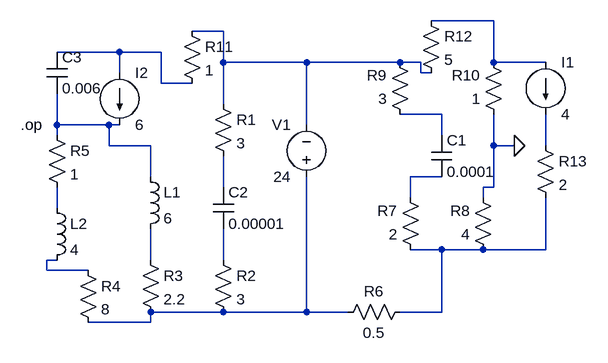
[diagram p0: schematic weirdRLC.asc]
weirdRLC.asc, the LTspice schematic file:
Version 4
SHEET 1 1008 680
WIRE 816 48 720 48
WIRE 400 64 352 64
WIRE 240 96 144 96
WIRE 304 96 240 96
WIRE 400 112 400 64
WIRE 528 112 400 112
WIRE 672 112 528 112
WIRE 704 112 672 112
WIRE 816 112 816 48
WIRE 896 112 816 112
WIRE 240 128 240 96
WIRE 704 128 704 112
WIRE 720 128 704 128
WIRE 304 144 304 96
WIRE 352 144 304 144
WIRE 400 176 400 112
WIRE 736 192 672 192
WIRE 144 208 144 160
WIRE 224 208 144 208
WIRE 240 208 224 208
WIRE 528 208 528 112
WIRE 144 224 144 208
WIRE 736 224 736 192
WIRE 224 240 224 208
WIRE 288 240 224 240
WIRE 816 240 816 192
WIRE 848 240 816 240
WIRE 896 240 896 192
WIRE 288 288 288 240
WIRE 736 288 688 288
WIRE 400 304 400 256
WIRE 816 304 816 240
WIRE 816 304 800 304
WIRE 688 320 688 288
WIRE 800 320 800 304
WIRE 144 336 144 304
WIRE 736 400 688 400
WIRE 800 400 736 400
WIRE 896 400 896 320
WIRE 896 400 800 400
WIRE 144 416 128 416
WIRE 288 416 288 368
WIRE 400 416 400 368
WIRE 128 432 128 416
WIRE 192 432 128 432
WIRE 400 496 288 496
WIRE 528 496 528 288
WIRE 528 496 400 496
WIRE 592 496 528 496
WIRE 736 496 736 400
WIRE 736 496 672 496
WIRE 288 512 288 496
WIRE 288 512 192 512
FLAG 848 240 0
SYMBOL res 688 480 R90
WINDOW 0 0 56 VBottom 2
WINDOW 3 32 56 VTop 2
SYMATTR InstName R6
SYMATTR Value 0.5
SYMBOL res 704 416 R180
WINDOW 0 36 76 Left 2
WINDOW 3 36 40 Left 2
SYMATTR InstName R7
SYMATTR Value 2
SYMBOL res 816 416 R180
WINDOW 0 36 76 Left 2
WINDOW 3 36 40 Left 2
SYMATTR InstName R8
SYMATTR Value 4
SYMBOL res 688 208 R180
WINDOW 0 36 76 Left 2
WINDOW 3 36 40 Left 2
SYMATTR InstName R9
SYMATTR Value 3
SYMBOL res 832 208 R180
WINDOW 0 36 76 Left 2
WINDOW 3 36 40 Left 2
SYMATTR InstName R10
SYMATTR Value 1
SYMBOL voltage 528 304 R180
WINDOW 0 24 96 Left 2
WINDOW 3 24 16 Left 2
SYMATTR InstName V1
SYMATTR Value 24
SYMBOL cap 720 224 R0
SYMATTR InstName C1
SYMATTR Value 0.0001
SYMBOL res 880 224 R0
SYMATTR InstName R13
SYMATTR Value 2
SYMBOL current 896 112 R0
SYMATTR InstName I1
SYMATTR Value 4
SYMBOL current 240 128 R0
SYMATTR InstName I2
SYMATTR Value 6
SYMBOL ind 272 272 R0
SYMATTR InstName L1
SYMATTR Value 6
SYMBOL ind 128 320 R0
SYMATTR InstName L2
SYMATTR Value 4
SYMBOL cap 384 304 R0
SYMATTR InstName C2
SYMATTR Value 0.00001
SYMBOL res 384 160 R0
SYMATTR InstName R1
SYMATTR Value 3
SYMBOL res 384 400 R0
SYMATTR InstName R2
SYMATTR Value 3
SYMBOL res 272 400 R0
SYMATTR InstName R3
SYMATTR Value 2.2
SYMBOL res 176 416 R0
SYMATTR InstName R4
SYMATTR Value 8
SYMBOL res 128 208 R0
SYMATTR InstName R5
SYMATTR Value 1
SYMBOL res 336 48 R0
SYMATTR InstName R11
SYMATTR Value 1
SYMBOL res 704 32 R0
SYMATTR InstName R12
SYMATTR Value 5
SYMBOL cap 128 96 R0
SYMATTR InstName C3
SYMATTR Value 0.006
TEXT 88 208 Left 2 !.op

The netlist it stands for:
* weirdRLC.asc
R6 N010 N014 0.5
R7 N010 N007 2
R8 N010 0 4
R9 N004 N002 3
R10 0 N001 1
V1 N014 N002 24
C1 N004 N007 0.0001
R13 N006 N010 2
I1 N001 N006 4
I2 N003 N005 6
L1 N005 N012 6
L2 N009 N011 4
C2 N008 N013 0.00001
R1 N002 N008 3
R2 N013 N014 3
R3 N012 N014 2.2
R4 N011 N014 8
R5 N005 N009 1
R11 N002 N003 1
R12 N001 N002 5
C3 N003 N005 0.006
.op
.backanno
.end